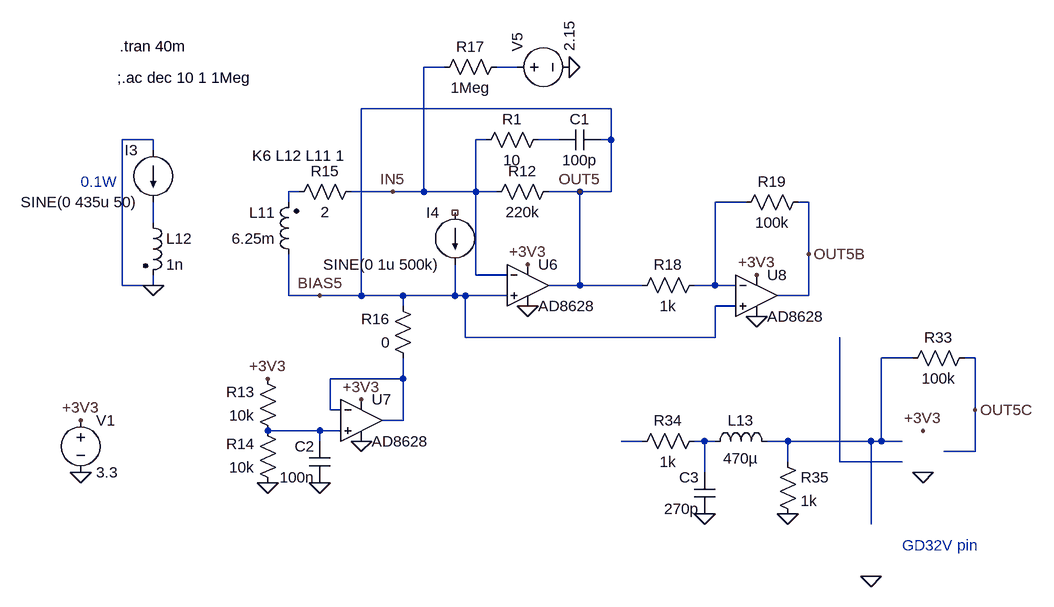
[diagram p0: schematic Current-Transformer2.asc]
Current-Transformer2.asc, the LTspice schematic file:
Version 4
SHEET 1 3888 1220
WIRE 3008 -112 2976 -112
WIRE 3120 -112 3088 -112
WIRE 3264 -48 2880 -48
WIRE 2560 0 2512 0
WIRE 3072 0 3056 0
WIRE 3184 0 3152 0
WIRE 3264 0 3264 -48
WIRE 3264 0 3248 0
WIRE 2560 16 2560 0
WIRE 2784 80 2768 80
WIRE 2928 80 2864 80
WIRE 2976 80 2976 -112
WIRE 2976 80 2928 80
WIRE 3056 80 3056 0
WIRE 3056 80 2976 80
WIRE 3088 80 3056 80
WIRE 3216 80 3168 80
WIRE 3264 80 3264 0
WIRE 3264 80 3216 80
WIRE 2768 96 2768 80
WIRE 3472 96 3424 96
WIRE 3568 96 3552 96
WIRE 2560 128 2560 96
WIRE 3568 176 3568 96
WIRE 3056 208 3056 80
WIRE 3104 208 3056 208
WIRE 2512 224 2512 0
WIRE 2560 224 2560 208
WIRE 2560 224 2512 224
WIRE 3216 224 3216 80
WIRE 3216 224 3168 224
WIRE 3312 224 3216 224
WIRE 3424 224 3424 96
WIRE 3424 224 3392 224
WIRE 3456 224 3424 224
WIRE 2768 240 2768 176
WIRE 2816 240 2768 240
WIRE 2880 240 2880 -48
WIRE 2880 240 2816 240
WIRE 2944 240 2880 240
WIRE 3024 240 3024 192
WIRE 3024 240 2944 240
WIRE 3040 240 3024 240
WIRE 3104 240 3040 240
WIRE 3568 240 3568 176
WIRE 3568 240 3520 240
WIRE 2944 256 2944 240
WIRE 3456 256 3424 256
WIRE 3040 304 3040 240
WIRE 3424 304 3424 256
WIRE 3424 304 3040 304
WIRE 3728 336 3680 336
WIRE 3824 336 3808 336
WIRE 2944 368 2944 336
WIRE 2944 368 2832 368
WIRE 2832 416 2832 368
WIRE 2848 416 2832 416
WIRE 3824 416 3824 336
WIRE 2944 432 2944 368
WIRE 2944 432 2912 432
WIRE 2816 448 2736 448
WIRE 2848 448 2816 448
WIRE 2816 464 2816 448
WIRE 3312 464 3280 464
WIRE 3408 464 3392 464
WIRE 3424 464 3408 464
WIRE 3536 464 3504 464
WIRE 3664 464 3536 464
WIRE 3680 464 3680 336
WIRE 3680 464 3664 464
WIRE 3712 464 3680 464
WIRE 3824 480 3824 416
WIRE 3824 480 3776 480
WIRE 3536 496 3536 464
WIRE 3616 496 3616 304
WIRE 3712 496 3616 496
WIRE 3408 512 3408 464
WIRE 3664 592 3664 464
FLAG 3216 80 OUT5
FLAG 2928 80 IN5
FLAG 3136 256 0
FLAG 2736 528 0
FLAG 3136 192 +3V3
FLAG 2736 368 +3V3
FLAG 2816 240 BIAS5
FLAG 2816 528 0
FLAG 2880 400 +3V3
FLAG 2880 464 0
FLAG 2560 224 0
FLAG 3200 -112 0
FLAG 3488 272 0
FLAG 3488 208 +3V3
FLAG 3568 176 OUT5B
FLAG 3744 512 0
FLAG 3744 448 +3V3
FLAG 3824 416 OUT5C
FLAG 3408 576 0
FLAG 3536 576 0
FLAG 3664 672 0
FLAG 2448 512 0
FLAG 2448 432 +3V3
SYMBOL res 3184 64 R90
WINDOW 0 0 56 VBottom 2
WINDOW 3 32 56 VTop 2
SYMATTR InstName R12
SYMATTR Value 220k
SYMBOL ind2 2784 192 R180
WINDOW 0 36 80 Left 2
WINDOW 3 36 40 Left 2
SYMATTR InstName L11
SYMATTR Value 6.25m
SYMATTR Type ind
SYMBOL res 2752 464 R180
WINDOW 0 36 76 Left 2
WINDOW 3 36 40 Left 2
SYMATTR InstName R13
SYMATTR Value 10k
SYMBOL res 2752 544 R180
WINDOW 0 36 76 Left 2
WINDOW 3 36 40 Left 2
SYMATTR InstName R14
SYMATTR Value 10k
SYMBOL cap 2832 528 R180
WINDOW 0 24 56 Left 2
WINDOW 3 24 8 Left 2
SYMATTR InstName C2
SYMATTR Value 100n
SYMBOL ind2 2544 112 R0
SYMATTR InstName L12
SYMATTR Value 1n
SYMATTR Type ind
SYMBOL res 2880 64 R90
WINDOW 0 0 56 VBottom 2
WINDOW 3 32 56 VTop 2
SYMATTR InstName R15
SYMATTR Value 2
SYMBOL Opamps\\AD8628 2880 368 R0
SYMATTR InstName U7
SYMBOL current 2560 16 M0
WINDOW 123 24 108 Left 2
WINDOW 39 0 0 Left 0
SYMATTR InstName I3
SYMATTR Value SINE(0 435u 50)
SYMBOL res 2960 352 R180
WINDOW 0 36 76 Left 2
WINDOW 3 36 40 Left 2
SYMATTR InstName R16
SYMATTR Value 0
SYMBOL Opamps\\AD8628 3136 160 R0
SYMATTR InstName U6
SYMBOL res 3104 -128 R90
WINDOW 0 0 56 VBottom 2
WINDOW 3 32 56 VTop 2
SYMATTR InstName R17
SYMATTR Value 1Meg
SYMBOL voltage 3104 -112 R270
WINDOW 123 0 0 Left 0
WINDOW 39 0 0 Left 0
SYMATTR InstName V5
SYMATTR Value 2.15
SYMBOL Opamps\\AD8628 3488 176 R0
SYMATTR InstName U8
SYMBOL res 3408 208 R90
WINDOW 0 0 56 VBottom 2
WINDOW 3 32 56 VTop 2
SYMATTR InstName R18
SYMATTR Value 1k
SYMBOL res 3568 80 R90
WINDOW 0 0 56 VBottom 2
WINDOW 3 32 56 VTop 2
SYMATTR InstName R19
SYMATTR Value 100k
SYMBOL res 3824 320 R90
WINDOW 0 0 56 VBottom 2
WINDOW 3 32 56 VTop 2
SYMATTR InstName R33
SYMATTR Value 100k
SYMBOL res 3408 448 R90
WINDOW 0 0 56 VBottom 2
WINDOW 3 32 56 VTop 2
SYMATTR InstName R34
SYMATTR Value 1k
SYMBOL cap 3424 576 R180
WINDOW 0 24 56 Left 2
WINDOW 3 24 8 Left 2
SYMATTR InstName C3
SYMATTR Value 270p
SYMBOL res 3520 480 R0
SYMATTR InstName R35
SYMATTR Value 1k
SYMBOL ind 3408 480 R270
WINDOW 0 32 56 VTop 2
WINDOW 3 5 56 VBottom 2
SYMATTR InstName L13
SYMATTR Value 470µ
SYMBOL current 3024 112 M0
WINDOW 123 24 108 Left 2
WINDOW 39 0 0 Left 0
SYMATTR InstName I4
SYMATTR Value SINE(0 1u 500k)
SYMBOL voltage 2448 416 R0
WINDOW 123 0 0 Left 0
WINDOW 39 0 0 Left 0
SYMATTR InstName V1
SYMATTR Value 3.3
SYMBOL res 3168 -16 R90
WINDOW 0 0 56 VBottom 2
WINDOW 3 32 56 VTop 2
SYMATTR InstName R1
SYMATTR Value 10
SYMBOL cap 3184 16 R270
WINDOW 0 32 32 VTop 2
WINDOW 3 0 32 VBottom 2
SYMATTR InstName C1
SYMATTR Value 100p
TEXT 2712 24 Left 2 !K6 L12 L11 1
TEXT 2448 64 Left 2 ;0.1W
TEXT 3712 624 Left 2 ;GD32V pin
TEXT 2508 -144 Left 2 !.tran 40m
TEXT 2504 -96 Left 2 !;.ac dec 10 1 1Meg

The netlist it stands for:
* Current-Transformer2.asc
R12 BIAS5 IN5 220k
L11 BIAS5 N003 6.25m
R13 N008 +3V3 10k
R14 0 N008 10k
C2 0 N008 100n
L12 N005 0 1n
R15 IN5 N003 2
XU7 N008 N007 +3V3 0 N007 AD8628  ; pins In+ In- V+ V- OUT
I3 0 N005 SINE(0 435u 50)
R16 N007 BIAS5 0
XU6 BIAS5 IN5 +3V3 0 BIAS5 AD8628  ; pins In+ In- V+ V- OUT
R17 N001 IN5 1Meg
V5 N001 0 2.15
XU8 BIAS5 N004 +3V3 0 OUT5B AD8628  ; pins In+ In- V+ V- OUT
R18 N004 BIAS5 1k
R19 OUT5B N004 100k
R33 OUT5C N006 100k
R34 N010 N009 1k
C3 0 N010 270p
R35 N006 0 1k
L13 N010 N006 470µ
I4 NC_01 BIAS5 SINE(0 1u 500k)
V1 +3V3 0 3.3
R1 N002 IN5 10
C1 N002 BIAS5 100p
K6 L12 L11 1
* 0.1W
* GD32V pin
.tran 40m
;.ac dec 10 1 1Meg
.backanno
.end